# Altium schematic sheet Outgoing_connectors.SchDoc
size A4
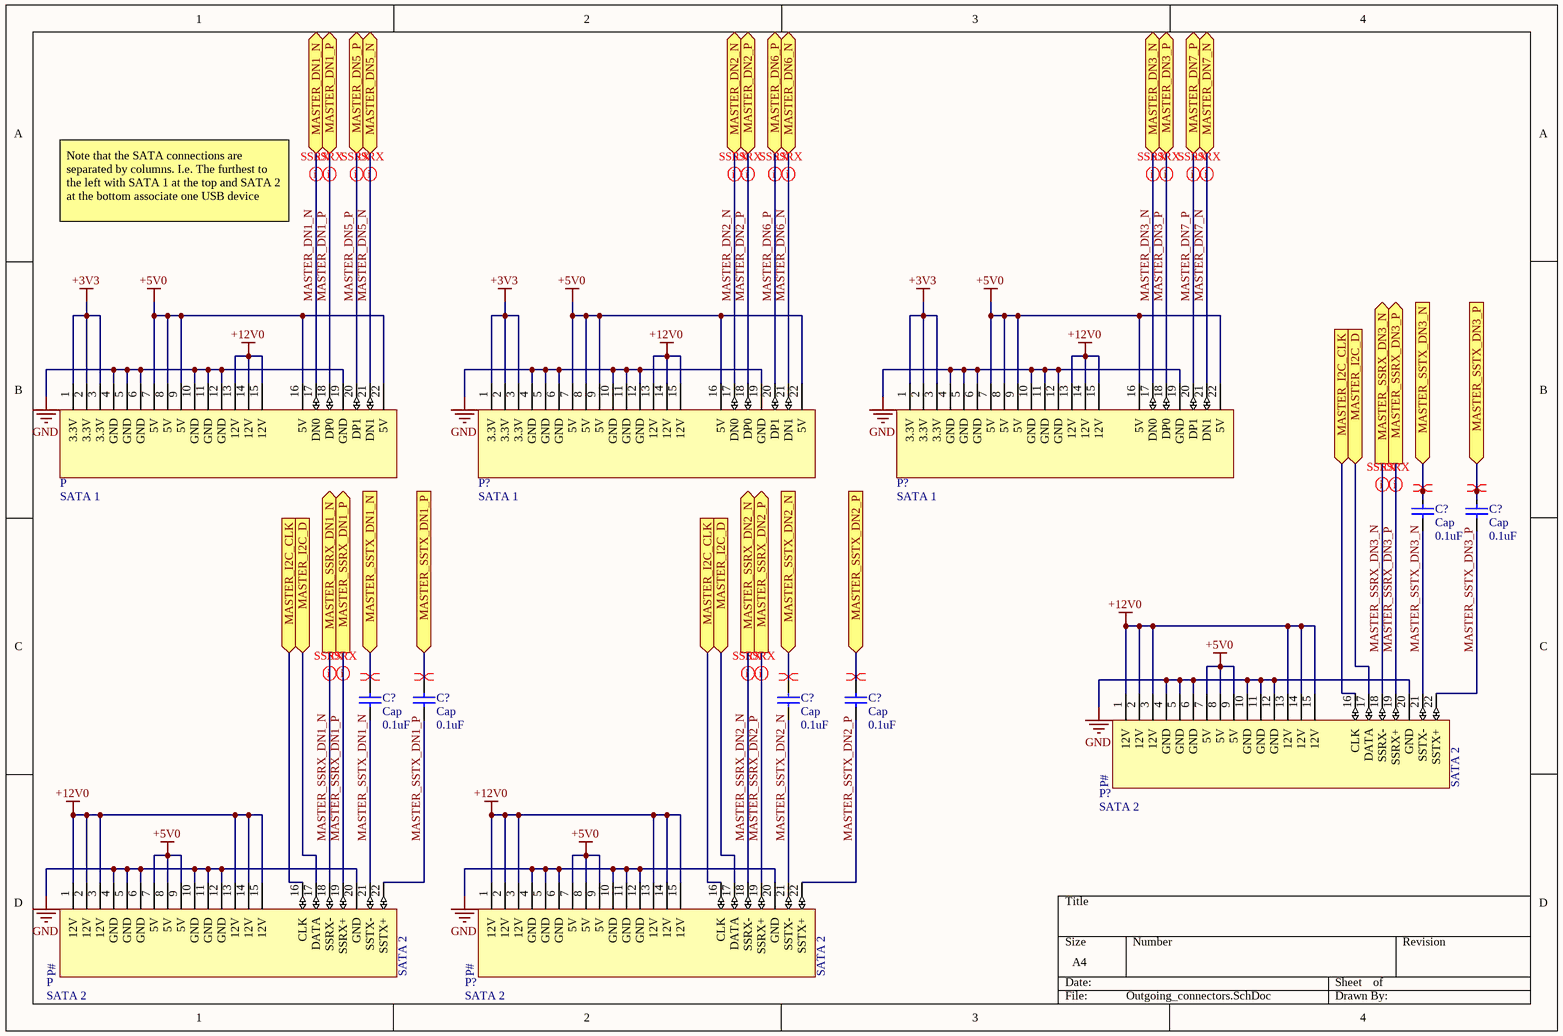
[diagram p0: Outgoing_connectors.SchDoc]

## Parts
(Parts that share a designator on the sheet are numbered #1, #2 ... from top to bottom, then left to right.)
C?#1  Cap  value 0.1uF  [RAD-0.3]
C?#2  Cap  value 0.1uF  [RAD-0.3]
C?#3  Cap  value 0.1uF  [RAD-0.3]
C?#4  Cap  value 0.1uF  [RAD-0.3]
C?#5  Cap  value 0.1uF  [RAD-0.3]
C?#6  Cap  value 0.1uF  [RAD-0.3]
P#1  SATA 1  [SATA Female]
P#2  SATA 2  [SATA Female]
P?#1  SATA 1  [SATA Female]
P?#2  SATA 1  [SATA Female]
P?#3  SATA 2  [SATA Female]
P?#4  SATA 2  [SATA Female]

## Ports
MASTER_DN1_N (bidir), MASTER_DN1_P (bidir), MASTER_DN2_N (bidir), MASTER_DN2_P (bidir), MASTER_DN3_N (bidir), MASTER_DN3_P (bidir), MASTER_DN5_N (bidir), MASTER_DN5_P (bidir), MASTER_DN6_N (bidir), MASTER_DN6_P (bidir), MASTER_DN7_N (bidir), MASTER_DN7_P (bidir), MASTER_I2C_CLK (in), MASTER_I2C_D (in), MASTER_SSRX_DN1_N (out), MASTER_SSRX_DN1_P (out), MASTER_SSRX_DN2_N (out), MASTER_SSRX_DN2_P (out), MASTER_SSRX_DN3_N (out), MASTER_SSRX_DN3_P (out), MASTER_SSTX_DN1_N (in), MASTER_SSTX_DN1_P (in), MASTER_SSTX_DN2_N (in), MASTER_SSTX_DN2_P (in), MASTER_SSTX_DN3_N (in), MASTER_SSTX_DN3_P (in)

## Nets
+3V3: P#1.1(3.3V) P#1.2(3.3V) P#1.3(3.3V) P?#1.1(3.3V) P?#1.2(3.3V) P?#1.3(3.3V) P?#2.1(3.3V) P?#2.2(3.3V) P?#2.3(3.3V)
+5V0: P#1.7(5V) P#1.8(5V) P#1.9(5V) P#1.16(5V) P#1.22(5V) P#2.7(5V) P#2.8(5V) P#2.9(5V) P?#1.7(5V) P?#1.8(5V) P?#1.9(5V) P?#1.16(5V) P?#1.22(5V) P?#2.7(5V) P?#2.8(5V) P?#2.9(5V) P?#2.16(5V) P?#2.22(5V) P?#3.7(5V) P?#3.8(5V) P?#3.9(5V) P?#4.7(5V) P?#4.8(5V) P?#4.9(5V)
+12V0: P#1.13(12V) P#1.14(12V) P#1.15(12V) P#2.1(12V) P#2.2(12V) P#2.3(12V) P#2.13(12V) P#2.14(12V) P#2.15(12V) P?#1.13(12V) P?#1.14(12V) P?#1.15(12V) P?#2.13(12V) P?#2.14(12V) P?#2.15(12V) P?#3.1(12V) P?#3.2(12V) P?#3.3(12V) P?#3.13(12V) P?#3.14(12V) P?#3.15(12V) P?#4.1(12V) P?#4.2(12V) P?#4.3(12V) P?#4.13(12V) P?#4.14(12V) P?#4.15(12V)
GND: P#1.4(GND) P#1.5(GND) P#1.6(GND) P#1.10(GND) P#1.11(GND) P#1.12(GND) P#1.19(GND) P#2.4(GND) P#2.5(GND) P#2.6(GND) P#2.10(GND) P#2.11(GND) P#2.12(GND) P#2.20(GND) P?#1.4(GND) P?#1.5(GND) P?#1.6(GND) P?#1.10(GND) P?#1.11(GND) P?#1.12(GND) P?#1.19(GND) P?#2.4(GND) P?#2.5(GND) P?#2.6(GND) P?#2.10(GND) P?#2.11(GND) P?#2.12(GND) P?#2.19(GND) P?#3.4(GND) P?#3.5(GND) P?#3.6(GND) P?#3.10(GND) P?#3.11(GND) P?#3.12(GND) P?#3.20(GND) P?#4.4(GND) P?#4.5(GND) P?#4.6(GND) P?#4.10(GND) P?#4.11(GND) P?#4.12(GND) P?#4.20(GND)
MASTER_DN1_N: P#1.17(DN0) ; port MASTER_DN1_N
MASTER_DN1_P: P#1.18(DP0) ; port MASTER_DN1_P
MASTER_DN2_N: P?#1.17(DN0) ; port MASTER_DN2_N
MASTER_DN2_P: P?#1.18(DP0) ; port MASTER_DN2_P
MASTER_DN3_N: P?#2.17(DN0) ; port MASTER_DN3_N
MASTER_DN3_P: P?#2.18(DP0) ; port MASTER_DN3_P
MASTER_DN5_N: P#1.21(DN1) ; port MASTER_DN5_N
MASTER_DN5_P: P#1.20(DP1) ; port MASTER_DN5_P
MASTER_DN6_N: P?#1.21(DN1) ; port MASTER_DN6_N
MASTER_DN6_P: P?#1.20(DP1) ; port MASTER_DN6_P
MASTER_DN7_N: P?#2.21(DN1) ; port MASTER_DN7_N
MASTER_DN7_P: P?#2.20(DP1) ; port MASTER_DN7_P
MASTER_I2C_CLK: P#2.16(CLK) P?#3.16(CLK) P?#4.16(CLK) ; port MASTER_I2C_CLK
MASTER_I2C_D: P#2.17(DATA) P?#3.17(DATA) P?#4.17(DATA) ; port MASTER_I2C_D
MASTER_SSRX_DN1_N: P#2.18(SSRX-) ; port MASTER_SSRX_DN1_N
MASTER_SSRX_DN1_P: P#2.19(SSRX+) ; port MASTER_SSRX_DN1_P
MASTER_SSRX_DN2_N: P?#4.18(SSRX-) ; port MASTER_SSRX_DN2_N
MASTER_SSRX_DN2_P: P?#4.19(SSRX+) ; port MASTER_SSRX_DN2_P
MASTER_SSRX_DN3_N: P?#3.18(SSRX-) ; port MASTER_SSRX_DN3_N
MASTER_SSRX_DN3_P: P?#3.19(SSRX+) ; port MASTER_SSRX_DN3_P
MASTER_SSTX_DN1_N: C?#3.1 P#2.21(SSTX-)
MASTER_SSTX_DN1_N: C?#3.2 ; port MASTER_SSTX_DN1_N  [a separate net that carries the same name]
MASTER_SSTX_DN1_P: C?#4.1 P#2.22(SSTX+)
MASTER_SSTX_DN1_P: C?#4.2 ; port MASTER_SSTX_DN1_P  [a separate net that carries the same name]
MASTER_SSTX_DN2_N: C?#5.1 P?#4.21(SSTX-)
MASTER_SSTX_DN2_N: C?#5.2 ; port MASTER_SSTX_DN2_N  [a separate net that carries the same name]
MASTER_SSTX_DN2_P: C?#6.1 P?#4.22(SSTX+)
MASTER_SSTX_DN2_P: C?#6.2 ; port MASTER_SSTX_DN2_P  [a separate net that carries the same name]
MASTER_SSTX_DN3_N: C?#1.1 P?#3.21(SSTX-)
MASTER_SSTX_DN3_N: C?#1.2 ; port MASTER_SSTX_DN3_N  [a separate net that carries the same name]
MASTER_SSTX_DN3_P: C?#2.1 P?#3.22(SSTX+)
MASTER_SSTX_DN3_P: C?#2.2 ; port MASTER_SSTX_DN3_P  [a separate net that carries the same name]

## Layout directives
differential pair; rule Signal Stimulus [Kind - Single Pulse    Level - High    Start Time = 0.000    Stop Time = 200.0p    Period Time = 400.0p]: (no net found under the mark), MASTER_DN1_N, MASTER_DN1_P, MASTER_DN2_N, MASTER_DN2_P, MASTER_DN3_N, MASTER_DN3_P, MASTER_DN5_N, MASTER_DN5_P, MASTER_DN6_N, MASTER_DN6_P, MASTER_DN7_N, MASTER_DN7_P, MASTER_SSRX_DN1_N, MASTER_SSRX_DN1_P, MASTER_SSRX_DN2_N, MASTER_SSRX_DN2_P, MASTER_SSRX_DN3_N, MASTER_SSRX_DN3_P

## Notes on the sheet
- Note that the SATA connections are separated by columns. I.e. The furthest to the left with SATA 1 at the top and SATA 2 at the bottom associate one USB device
- (in symbol SATA 2) P#

## Library data of the parts
C?#1-C?#6 = Cap: Capacitor; Published: 8-Jun-2000; LatestRevisionDate: 17-Jul-2002; LatestRevisionNote: Re-released for DXP Platform.; PackageReference: RAD-0.3; Publisher: Altium Limited; PackageDescription: Radial Cap, Thru-Hole; 2 Leads; 0.3 in Pin Spacing
P#1 P?#1 P?#2 = SATA 1: SATA connector. / Connector 1 for option 1 as per Spec; Supplier 1: Digi-Key
P#2 P?#3 P?#4 = SATA 2: SATA connector. / Connector 2 for option 1 as per Spec; Supplier 1: Digi-Key